# EAGLE design zedboard (EAGLE 9.0.1)
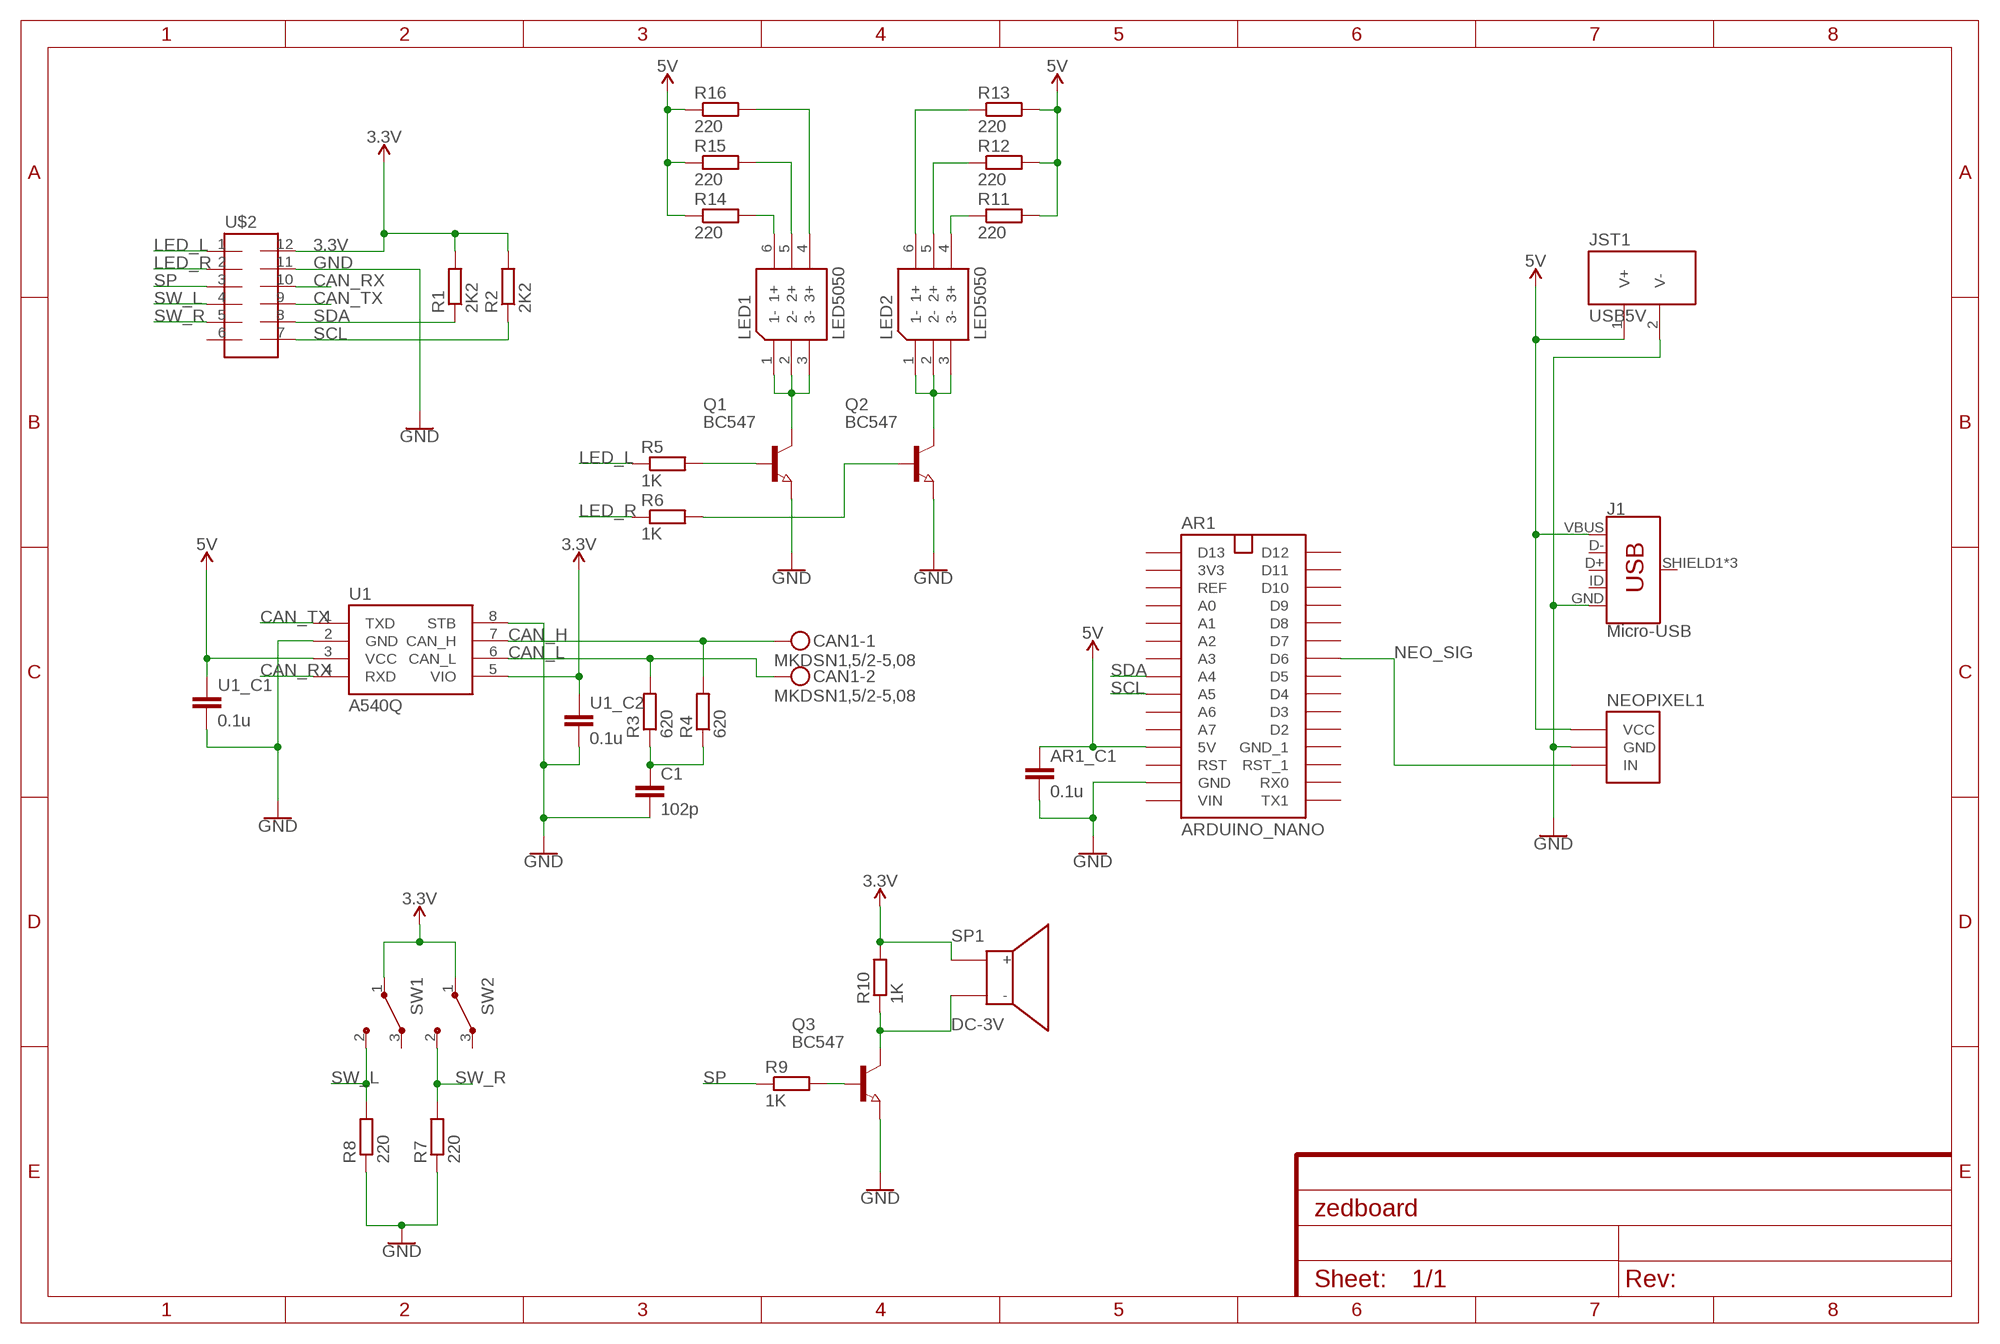
[diagram p0: schematic, sheet 1]

## Parts
AR1  ARDUINO_NANO  [ARDUINO_NANO]
AR1_C1  0.1u  C-EUC0805  [C0805]
C1  102p  CC1206  [C1206]
CAN1  MKDSN1,5/2-5,08  [MKDSN1,5/2-5,08]
J1  Micro-USB  USB_MICRO-BREDUCED_PASTE  [USB-B-MICRO-SMD_RED_PASTE]
JST1  USB5V  POWER_CON  [POWER_2MM]
LED1  LED5050  [LED-TRICOLOR-5050]
LED2  LED5050  [LED-TRICOLOR-5050]
NEOPIXEL1  NEOPIXEL  [NEOPIXEL_RING_16]
Q1  BC547  NPN-TRANSISTOR_SOT23  [SOT23]
Q2  BC547  NPN-TRANSISTOR_SOT23  [SOT23]
Q3  BC547  NPN-TRANSISTOR_SOT23  [SOT23]
R1  2K2  R-EU_R0805  [R0805]
R2  2K2  R-EU_R0805  [R0805]
R3  620  RR1206  [R1206]
R4  620  RR1206  [R1206]
R5  1K  R-EU_R1206  [R1206]
R6  1K  R-EU_R1206  [R1206]
R7  220  R-EU_R1206  [R1206]
R8  220  R-EU_R1206  [R1206]
R9  1K  R-EU_R1206  [R1206]
R10  1K  R-EU_R1206  [R1206]
R11  220  R-EU_R1206  [R1206]
R12  220  R-EU_R1206  [R1206]
R13  220  R-EU_R1206  [R1206]
R14  220  R-EU_R1206  [R1206]
R15  220  R-EU_R1206  [R1206]
R16  220  R-EU_R1206  [R1206]
SP1  DC-3V  SPEAKER  [SPEAKER_2MM_CON]
SW1  1A125V  MICRO-SW  [MICRO_SW_1A]
SW2  1A125V  MICRO-SW  [MICRO_SW_1A]
U1  A540Q  DA5408  [SOIC8]
U1_C1  0.1u  C-EUC0805  [C0805]
U1_C2  0.1u  C-EUC0805  [C0805]
U$2  HEARDER_6X2  [HEADER_6X2_L]

## Nets
3.3V: R1.2 R2.2 R10.2 SP1.P$1(+) SW1.1(C) SW2.1(C) U1.5(VIO) U1_C2.1 U$2.12
5V: AR1.P$12(5V) AR1_C1.1 J1.VBUS JST1.1(V+) NEOPIXEL1.P$1(VCC) R11.2 R12.2 R13.2 R14.1 R15.1 R16.1 U1.3(VCC) U1_C1.1
CAN_H: CAN1.1 R4.2 U1.7(CAN_H)
CAN_L: CAN1.2 R3.2 U1.6(CAN_L)
CAN_RX: U1.4(RXD) U$2.10
CAN_TX: U1.1(TXD) U$2.9
GND: AR1.P$14(GND) AR1_C1.2 C1.2 J1.GND JST1.2(V-) NEOPIXEL1.P$2(GND) Q1.2(E) Q2.2(E) Q3.2(E) R7.1 R8.1 U1.2(GND) U1.8(STB) U1_C1.2 U1_C2.2 U$2.11
LED_L: R5.1 U$2.1
LED_R: R6.1 U$2.2
N$1: C1.1 R3.1 R4.1
N$2: Q1.1(B) R5.2
N$3: LED1.1(1-) LED1.2(2-) LED1.3(3-) Q1.3(C)
N$4: LED2.1(1-) LED2.2(2-) LED2.3(3-) Q2.3(C)
N$5: Q2.1(B) R6.2
N$7: Q3.3(C) R10.1 SP1.P$2(-)
N$8: Q3.1(B) R9.2
N$9: LED1.4(3+) R16.2
N$10: LED1.5(2+) R15.2
N$11: LED1.6(1+) R14.2
N$12: LED2.4(3+) R11.1
N$13: LED2.5(2+) R12.1
N$14: LED2.6(1+) R13.1
NEO_SIG: AR1.P$24(D6) NEOPIXEL1.P$3(IN)
SCL: AR1.P$9(A5) R2.1 U$2.7
SDA: AR1.P$8(A4) R1.1 U$2.8
SP: R9.1 U$2.3
SW_L: R8.2 SW1.2(NO) U$2.4
SW_R: R7.2 SW2.2(NO) U$2.5
Unconnected: AR1.P$1(D13) AR1.P$2(3V3) AR1.P$3(REF) AR1.P$4(A0) AR1.P$5(A1) AR1.P$6(A2) AR1.P$7(A3) AR1.P$10(A6) AR1.P$11(A7) AR1.P$13(RST) AR1.P$15(VIN) AR1.P$16(TX1) AR1.P$17(RX0) AR1.P$18(RST_1) AR1.P$19(GND_1) AR1.P$20(D2) AR1.P$21(D3) AR1.P$22(D4) AR1.P$23(D5) AR1.P$25(D7) AR1.P$26(D8) AR1.P$27(D9) AR1.P$28(D10) AR1.P$29(D11) AR1.P$30(D12) J1.D+ J1.D- J1.ID J1.SHIELD1(SHIELD) J1.SHIELD2(SHIELD) J1.SHIELD3(SHIELD) SW1.3(NC) SW2.3(NC) U$2.6

## Library data of the parts
AR1 = Justin-Eagle-Lib:ARDUINO_NANO
AR1_C1 U1_C1 U1_C2 = rcl:C-EU: CAPACITOR, European symbol; SPICEPREFIX: C
C1 = eagle-ltspice:C: CAPACITOR, European symbol; SPICEMODEL: NONE; SPICEPREFIX: C
CAN1 = con-phoenix-508:MKDSN1,5/2-5,08: MKDSN 1,5/ 2-5,08 Printklemme Nennstrom: 13,5 A Nennspannung: 250 V Rastermaß: 5,08 mm Polzahl: 2 Anschlussart: Schraubanschluss Montage: Löten Anschlussrichtung Leiter/Platine: 0 ° Artikelnummer: 1729128 Source: http://eshop.phoenixcontact.com .. 1729128.pdf
J1 = SparkFun-Connectors:USB_MICRO-B: USB Type Micro-B Connector Male/female and PTH/SMT variants SparkFun Products: SparkFun microB USB Breakout <https://www.sparkfun.com/products/12035> SparkFun USB microB Plug Breakout <https://www.sparkfun.com/products/10031> SparkFun ESP8266 Thing <https://www.sparkfun.com/products/13231>; PROD_ID: CONN-11752
JST1 = Justin-Eagle-Lib:POWER_CON
LED1 LED2 = Justin-Eagle-Lib:LED5050
NEOPIXEL1 = Justin-Eagle-Lib:NEOPIXEL
Q1-Q3 = semicon-smd-ipc:NPN-TRANSISTOR_: NPN TRANSISTOR
R1 R2 R5-R16 = rcl:R-EU_: RESISTOR, European symbol; SPICEPREFIX: R
R3 R4 = eagle-ltspice:R: RESISTOR, European symbol; SPICEMODEL: NONE; SPICEPREFIX: R
SP1 = Justin-Eagle-Lib:SPEAKER
SW1 SW2 = Justin-Eagle-Lib:MICRO-SW
U1 = Justin-Eagle-Lib:DA540
U$2 = connectors:HEARDER_6X2

## Net classes
0 default: clearance 0.205 mm

## Board
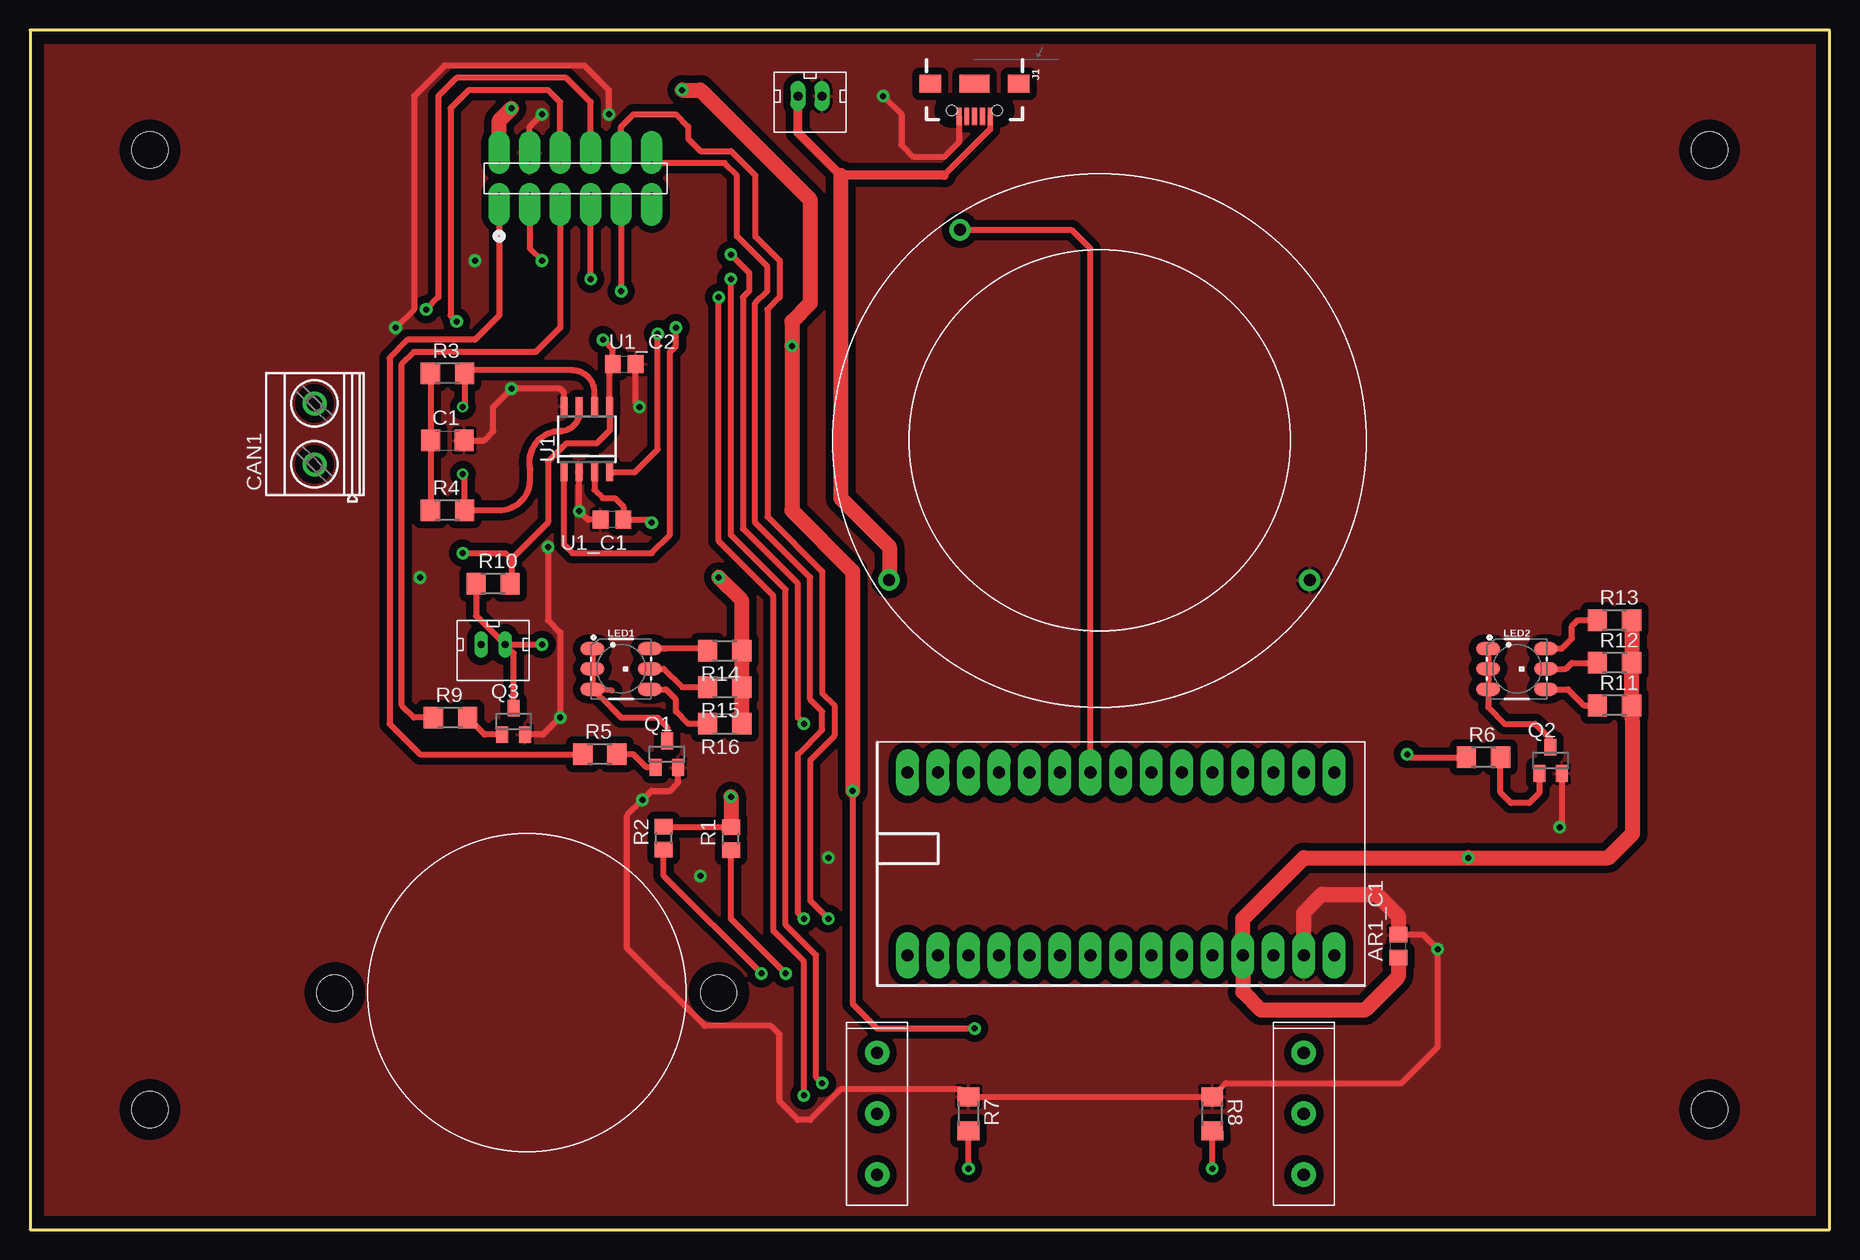
[diagram p1: board, top side]
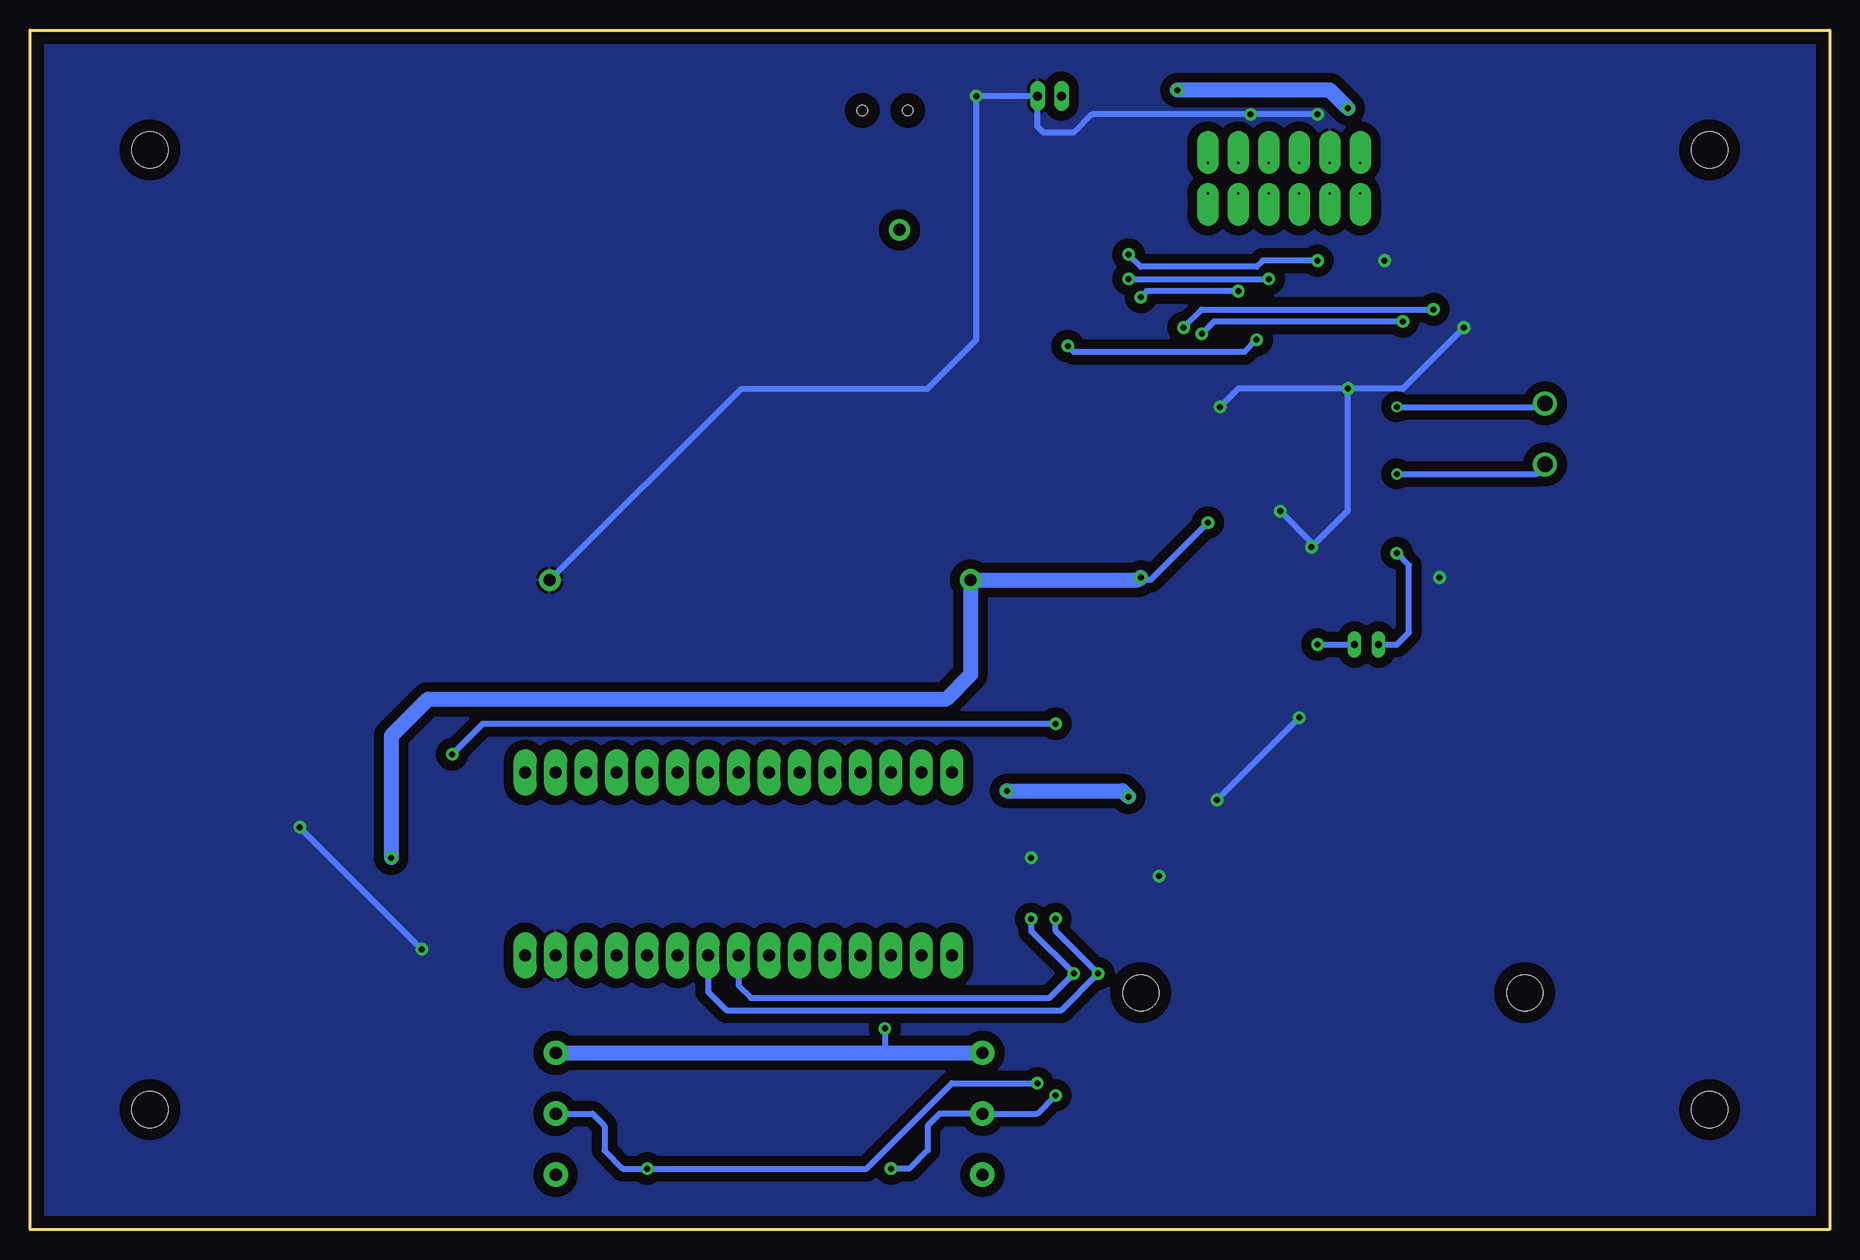
[diagram p2: board, bottom side, seen from below]

Size 150 x 100 mm. Coordinates in mm from the lower left corner, seen from the top.
Outline: 0,0 150,0 150,100 0,100 0,0
Copper layers (1*16): Top 0.035mm / dielectric 1.5mm / Bottom 0.035mm
Design rules "default": minimum track width 6mil, minimum drill 0.35mm, track to track 6mil, track to pad 6mil, pad to pad 6mil, via to via 6mil, smd to smd 6mil, copper to edge 40mil, drill to drill 6mil, minimum pad ring 10mil, minimum via ring 8mil, stop-mask expansion 4mil, vias tented up to drill 0mil, thermal gap 10mil
Holes 3 mm at 10,10 140,10 140,90 10,90

### Footprints (pad centres in the part's own frame; a part is rotated, then mirrored left to right if it is on the bottom)
ARDUINO_NANO = drill 1 pad 1.93 long: P$1 0,0; P$2 2.54,0; P$3 5.08,0; P$4 7.62,0; P$5 10.16,0; P$6 12.7,0; P$7 15.24,0; P$8 17.78,0; P$9 20.32,0; P$10 22.86,0; P$11 25.4,0; P$12 27.94,0; P$13 30.48,0; P$14 33.02,0; P$15 35.56,0; P$16 35.56,15.24; P$17 33.02,15.24; P$18 30.48,15.24; P$19 27.94,15.24; P$20 25.4,15.24; P$21 22.86,15.24; P$22 20.32,15.24; P$23 17.78,15.24; P$24 15.24,15.24; P$25 12.7,15.24; P$26 10.16,15.24; P$27 7.62,15.24; P$28 5.08,15.24; P$29 2.54,15.24; P$30 0,15.24
C0805 = smd 1.3 x 1.5: 1 -0.95,0; 2 0.95,0
C1206 = smd 1.6 x 1.8: 1 -1.4,0; 2 1.4,0
MKDSN1,5/2-5,08 = drill 1.3 pad 2: 1 -2.561,0.025; 2 2.519,0.025
USB-B-MICRO-SMD_RED_PASTE = smd 1.45 x 0.4: D+ 2.725,0; D- 2.725,0.65; GND 2.725,-1.3; ID 2.725,-0.65; VBUS 2.725,1.3 | smd 1.5 x 1.8: SHIELD1 0,3.685; SHIELD2 0,-3.685 | smd 1.5 x 2.5: SHIELD3 0,0 | hole 0.85: 2.2,1.9; 2.2,-1.9
POWER_2MM = drill 0.75 long: 1 0,0; 2 2,0
LED-TRICOLOR-5050 = smd 2 x 1.1: 1 -2.4,1.7; 2 -2.4,0; 3 -2.4,-1.7; 4 2.4,-1.7; 5 2.4,0; 6 2.4,1.7
NEOPIXEL_RING_16 = drill 1 pad 1.778: P$1 -17.551,-11.633; P$2 17.526,-11.659; P$3 -11.633,17.551
SOT23 = smd 1 x 1.4: 1 -0.95,-1.1; 2 0.95,-1.1; 3 0,1.1
R0805 = smd 1.3 x 1.5: 1 -0.95,0; 2 0.95,0
R1206 = smd 1.6 x 1.803: 1 -1.422,0; 2 1.422,0
SPEAKER_2MM_CON = drill 0.6 long: P$1 0,0; P$2 2,0 | hole 3: -12.19,-29.03; 19.81,-29.03
MICRO_SW_1A = drill 1.016 pad 2.032: 1 0,0; 2 5.08,0; 3 10.16,0
SOIC8 = smd 0.6 x 1.5: 1 -1.905,-2.75; 2 -0.635,-2.75; 3 0.635,-2.75; 4 1.905,-2.75; 5 1.905,2.75; 6 0.635,2.75; 7 -0.635,2.75; 8 -1.905,2.75
HEADER_6X2_L = drill 0.2 pad 1.778 offset: 1 0,0; 2 2.54,0; 3 5.08,0; 4 7.62,0; 5 10.16,0; 6 12.7,0; 7 12.7,2.54; 8 10.16,2.54; 9 7.62,2.54; 10 5.08,2.54; 11 2.54,2.54; 12 0,2.54

### Placement (x,y rotation side)
AR1  73.15,22.86 0 top
AR1_C1  114.05,23.62 90 top
C1  34.8,65.79 0 top
CAN1  23.74,66.35 90 top
J1  78.74,95.5 270 top
JST1  64.01,94.49 0 top
LED1  49.28,46.74 0 top
LED2  123.95,46.74 0 top
NEOPIXEL1  89.15,65.79 0 top
Q1  53.09,39.62 0 top
Q2  126.75,39.12 0 top
Q3  40.32,42.35 0 top
R1  58.42,32.58 90 top
R2  52.83,32.62 90 top
R3  34.8,71.37 0 top
R4  34.8,59.94 0 top
R5  47.5,39.62 0 top
R6  121.16,39.37 0 top
R7  78.23,9.65 270 top
R8  98.55,9.65 270.4 top
R9  35.05,42.67 0 top
R10  38.61,53.85 0 top
R11  132.08,43.69 0 top
R12  132.08,47.24 0 top
R13  132.08,50.8 0 top
R14  57.91,48.26 180 top
R15  57.91,45.21 180 top
R16  57.91,42.16 180 top
SP1  37.59,48.77 0 top
SW1  106.17,14.73 270 top
SW2  70.61,14.73 270 top
U1  46.42,65.88 0 top
U1_C1  48.51,59.18 180 top
U1_C2  49.53,72.14 0 top
U$2  39.12,86.36 0 top

### Tracks (layer width: path | path; a pad name or v marks a point on that pad's centre or on a via)
3.3V  (via drill 0.5 pad 1.05)
  Top 0.508: R1.2 52.87,33.53 R2.2 | v68.58,36.58 68.58,18.8 70.61,16.76 v78.74,16.76 | v36.07,56.39 39.62,56.39 40.13,55.88 | 40.13,55.88 40.13,53.95 R10.2 | v47.75,74.17 48.58,73.34 U1_C2.1 48.32,71.88 U1.5 48.32,66.61 47.24,65.53 44.7,65.53 43.18,64.01 43.18,58.93 40.13,55.88
  Top 1.27: U$2.12 39.12,92.46 v40.13,93.47 | v54.36,95 55.88,95 65.02,85.85 65.02,77.22 63.5,75.69 v63.5,73.66 63.5,59.94 68.58,54.86 v68.58,36.58 | v58.42,36.07 R1.2
  Bottom 0.508: v78.74,16.76 78.74,14.73 | SP1.P$1 36.07,48.77 35.05,49.78 35.05,55.37 v36.07,56.39 | v47.75,74.17 48.77,73.15 62.99,73.15 v63.5,73.66
  Bottom 1.27: SW1.1 78.74,14.73 SW2.1 | v40.13,93.47 41.66,95 v54.36,95 | v68.58,36.58 58.93,36.58 v58.42,36.07
5V  (via drill 0.5 pad 1.05)
  Top 0.508: U1.3 47.05,61.66 47.75,60.96 48.77,60.96 49.46,60.26 U1_C1.1 51.56,59.18 v51.82,58.93 | J1.VBUS 80.04,91.72 76.2,87.88
  Top 0.762: 76.2,87.88 67.56,87.88 64.01,91.44 JST1.1
  Top 1.27: AR1_C1.1 114.05,21.08 111.25,18.29 102.62,18.29 101.09,19.81 AR1.P$12 101.09,25.91 106.17,30.99 v119.89,30.99 131.57,30.99 133.6,33.02 133.6,42.06 R11.2 R12.2 R13.2 | 67.56,87.88 67.56,60.96 71.63,56.9 71.63,54.18 NEOPIXEL1.P$1 | v57.4,54.36 59.33,52.43 R14.1 R15.1 R16.1
  Bottom 0.508: v51.82,58.93 56.59,54.15 57.61,54.15
  Bottom 1.27: v57.4,54.36 57.61,54.15 NEOPIXEL1.P$1 71.6,46.25 73.66,44.2 116.84,44.2 119.89,41.15 v119.89,30.99
CAN_H  (via drill 0.5)
  Top 0.508: v36.07,62.99 arc-90 36.22,62.84 R4.2 39.12,59.94 arc90 41.66,62.48 41.66,62.99 arc-8 41.68,63.37 arc-103 44.2,66.55 arc90 45.78,68.13 U1.7
  Bottom 0.508: v36.07,62.99 24.51,62.99 arc-90 CAN1.1
CAN_L  (via drill 0.5)
  Top 0.508: U1.6 47.05,69.79 arc90 45.21,71.63 36.47,71.63 arc90 R3.2 36.22,68.73 arc-90 v36.07,68.58
  Bottom 0.508: v36.07,68.58 24.01,68.58 arc-90 CAN1.2
CAN_RX  (via drill 0.5 pad 1.05)
  Top 0.508: v35.56,75.69 35.05,76.2 35.05,93.47 36.58,95 43.18,95 44.2,93.98 U$2.10 | 48.46,62.99 U1.4 50.43,63.13 52.32,65.02 v52.32,74.68
  Bottom 0.508: v35.56,75.69 51.31,75.69 v52.32,74.68
CAN_TX  (via drill 0.5 pad 1.05)
  Top 0.508: v33.02,76.71 34.04,77.72 34.04,94.49 35.56,96.01 44.7,96.01 46.74,93.98 U$2.9 | U1.1 44.51,57.09 45.21,56.39 51.82,56.39 53.34,57.91 53.34,73.15 53.85,73.66 v53.85,75.18
  Bottom 0.508: v53.85,75.18 52.32,76.71 v33.02,76.71
GND  (via drill 0.5 pad 1.05)
  Top 0.508: C1.2 37.85,65.79 38.61,66.55 38.61,68.58 v40.13,70.1 44.2,70.1 44.51,69.79 U1.8 | v50.8,68.58 50.48,68.9 U1_C2.2 | v71.12,94.49 72.64,92.96 72.64,90.42 73.66,89.41 76.2,89.41 77.44,90.65 J1.GND | U1.2 v45.78,59.88 46.48,59.18 U1_C1.2 | Q1.2 54.04,37.27 53.34,36.58 51.82,36.58 v51.05,35.81 49.78,34.54 49.78,23.44 56.26,16.97 61.77,16.97 62.48,16.26 62.48,10.67 64.01,9.14 65.02,9.14 67.56,11.68 77.62,11.68 R7.1 R8.1 99.66,12.19 114.3,12.19 117.35,15.24 v117.35,23.37 116.14,24.57 AR1_C1.2 | v43.18,56.9 43.18,50.8 44.2,49.78 v44.2,42.67 42.78,41.25 Q3.2 | U$2.11 41.66,91.95 v42.67,92.96 | v48.26,92.96 48.26,95 46.23,97.03 34.54,97.03 32,94.49 32,76.71 v30.48,75.18 | Q2.2 127.7,33.72 v127.51,33.53
  Top 1.27: AR1.P$14 106.17,26.42 107.7,27.94 112.27,27.94 114.05,26.16 AR1_C1.2
  Bottom 0.508: v40.13,70.1 49.28,70.1 v50.8,68.58 | v45.78,59.88 43.18,57.28 v43.18,56.9 40.13,59.94 v40.13,70.1 | v44.2,42.67 v51.05,35.81 | v42.67,92.96 v48.26,92.96 61.47,92.96 62.99,91.44 65.53,91.44 66.04,91.95 66.01,91.98 JST1.2 v71.12,94.49 71.12,74.17 75.18,70.1 90.7,70.1 NEOPIXEL1.P$2 | v30.48,75.18 35.56,70.1 v40.13,70.1 | v127.51,33.53 v117.35,23.37
  other vias: 66.55,30.99 32.51,54.36 37.08,80.77 55.88,29.46
  pour Top (isolate 0.61): 0,0 0,100 150,100 150,0
  pour Bottom (isolate 0.813): 0,0 150,0 150,100 0,100
LED_L
  Top 0.508: R5.1 32.51,39.62 29.97,42.16 29.97,72.64 31.5,74.17 37.08,74.17 39.12,76.2 U$2.1
LED_R  (via drill 0.5 pad 1.05)
  Top 0.508: U$2.2 41.66,81.79 v42.67,80.77 | v58.42,81.28 59.94,79.76 59.94,78.23 59.44,77.72 59.44,58.42 64.01,53.85 64.01,42.67 v64.52,42.16 | v114.81,39.62 115.06,39.37 R6.1
  Bottom 0.508: v42.67,80.77 47.24,80.77 47.75,80.26 57.4,80.26 v58.42,81.28 | v64.52,42.16 112.27,42.16 v114.81,39.62
N$1
  Top 0.508: 33.38,66.32 C1.1 | R3.1 33.38,65.81 arc90 C1.1 | C1.1 33.4,59.97 arc-90 R4.1
N$2
  Top 0.508: Q1.1 51.39,38.52 50.29,39.62 R5.2
N$3
  Top 0.508: 48.51,44.92 LED1.3 | LED1.1 LED1.2 LED1.3 | LED1.3 48.4,43.55 49.28,42.67 52.32,42.67 53.09,41.91 Q1.3
N$4
  Top 0.508: LED2.1 LED2.2 LED2.3 121.55,43.55 122.94,42.16 125.48,42.16 126.75,40.89 Q2.3
N$5
  Top 0.508: Q2.1 125.8,36.39 124.97,35.56 123.44,35.56 122.58,36.42 R6.2
N$7  (via drill 0.5 pad 1.05)
  Top 0.508: 37.08,53.75 R10.1 37.19,51.17 SP1.P$2 | 40.13,43.64 Q3.3 40.32,48.04 SP1.P$2 | SP1.P$2 v42.67,48.77
  Bottom 0.508: v42.67,48.77 SP1.P$2
N$8
  Top 0.508: Q3.1 37.89,41.25 R9.2
N$9
  Top 0.508: LED1.4 53.01,45.04 53.85,44.2 53.85,43.18 54.86,42.16 R16.2
N$10
  Top 0.508: LED1.5 52.83,46.74 54.36,45.21 R15.2
N$11
  Top 0.508: 53.01,48.44 LED1.6 56.49,48.44 R14.2
N$12
  Top 0.508: LED2.4 128.19,45.04 129.54,43.69 R11.1
N$13
  Top 0.508: LED2.5 128.02,46.74 128.52,47.24 R12.1
N$14
  Top 0.508: LED2.6 127.68,48.44 128.52,49.28 128.52,50.29 129.03,50.8 R13.1
NEO_SIG
  Top 0.508: NEOPIXEL1.P$3 77.55,83.31 86.87,83.31 88.39,81.79 AR1.P$24
SCL  (via drill 0.5 pad 1.05)
  Top 0.508: v60.96,21.34 52.83,29.46 R2.1 | v64.52,25.91 64.01,26.42 64.01,39.62 66.04,41.66 66.04,43.18 65.02,44.2 65.02,54.36 60.45,58.93 60.45,77.22 61.47,78.23 61.47,80.26 58.93,82.8 58.93,87.88 57.91,88.9 U$2.7
  Bottom 0.508: AR1.P$9 93.47,19.81 91.95,18.29 64.01,18.29 v60.96,21.34 64.52,24.89 v64.52,25.91
SDA  (via drill 0.5 pad 1.05)
  Top 0.508: v62.99,21.34 58.42,25.91 R1.1 | U$2.8 49.28,91.95 50.29,92.96 53.85,92.96 54.86,91.95 54.86,90.93 55.88,89.92 58.42,89.92 60.45,87.88 60.45,82.8 62.48,80.77 62.48,77.72 61.47,76.71 61.47,59.44 66.04,54.86 66.04,44.7 67.06,43.69 67.06,41.15 65.02,39.12 65.02,27.43 v66.55,25.91
  Bottom 0.508: AR1.P$8 90.93,20.32 89.92,19.3 65.02,19.3 v62.99,21.34 66.55,24.89 v66.55,25.91
SP
  Top 0.508: R9.1 32,42.67 30.99,43.69 30.99,72.14 32,73.15 42.16,73.15 44.2,75.18 U$2.3
SW_L  (via drill 0.5 pad 1.05)
  Top 0.508: v98.55,5.08 R8.2 | v66.04,12.19 65.53,12.7 65.53,22.86 62.99,25.4 62.99,53.34 58.42,57.91 v58.42,79.25 | v46.74,79.25 U$2.4
  Bottom 0.508: SW1.2 103.12,9.65 102.11,8.64 102.11,6.6 100.58,5.08 v98.55,5.08 80.26,5.08 73.15,12.19 v66.04,12.19 | v58.42,79.25 v46.74,79.25
SW_R  (via drill 0.5 pad 1.05)
  Top 0.508: v78.23,5.08 R7.2 | v64.52,11.18 64.52,22.35 61.98,24.89 61.98,52.83 57.4,57.4 v57.4,77.72 | U$2.5 v49.28,78.23
  Bottom 0.508: v78.23,5.08 76.71,5.08 75.18,6.6 75.18,8.64 74.17,9.65 SW2.2 66.04,9.65 v64.52,11.18 | v49.28,78.23 56.9,78.23 v57.4,77.72